# EAGLE design chainable_shift_register (EAGLE 9.5.0)
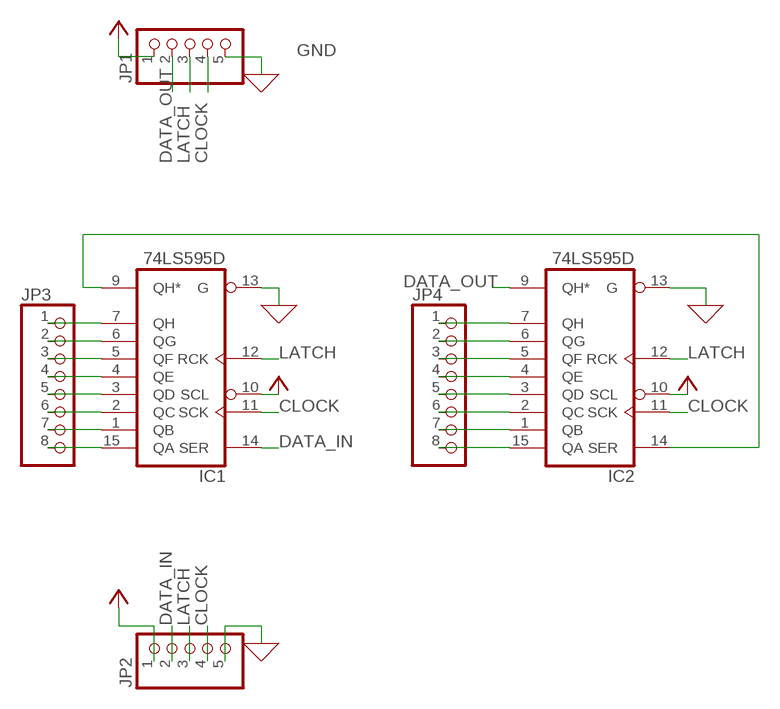
[diagram p0: schematic, sheet 1]

## Parts
IC1  74LS595D  [SO16]
IC2  74LS595D  [SO16]
JP1  PINHD-1X5  [1X05]
JP2  PINHD-1X5  [1X05]
JP3  PINHD-1X8  [1X08]
JP4  PINHD-1X8  [1X08]

## Nets
CLOCK: IC1.11(SCK) IC2.11(SCK) JP1.4 JP2.4
DATA_IN: IC1.14(SER) JP2.2
DATA_OUT: IC2.9(QH*) JP1.2
GND: IC1.13(G) IC2.13(G) JP1.5 JP2.5
LATCH: IC1.12(RCK) IC2.12(RCK) JP1.3 JP2.3
N$1: IC2.15(QA) JP4.8
N$2: IC2.1(QB) JP4.7
N$3: IC2.2(QC) JP4.6
N$4: IC2.3(QD) JP4.5
N$5: IC2.4(QE) JP4.4
N$6: IC2.5(QF) JP4.3
N$7: IC2.6(QG) JP4.2
N$8: IC2.7(QH) JP4.1
N$9: IC1.7(QH) JP3.1
N$10: IC1.6(QG) JP3.2
N$11: IC1.5(QF) JP3.3
N$12: IC1.4(QE) JP3.4
N$13: IC1.3(QD) JP3.5
N$14: IC1.2(QC) JP3.6
N$15: IC1.1(QB) JP3.7
N$16: IC1.15(QA) JP3.8
N$17: IC1.9(QH*) IC2.14(SER)
VCC: IC1.10(SCL) IC2.10(SCL) JP1.1 JP2.1

## Power pins joined to a net without a drawn wire
GND: IC1.8(GND) IC2.8(GND)
VCC: IC1.16(VCC) IC2.16(VCC)

## Library data of the parts
IC1 IC2 = 74xx-us:74*595: 8-bit SHIFT REGISTER, output latch
JP1 JP2 = pinhead:PINHD-1X5: PIN HEADER
JP3 JP4 = pinhead:PINHD-1X8: PIN HEADER

## Board
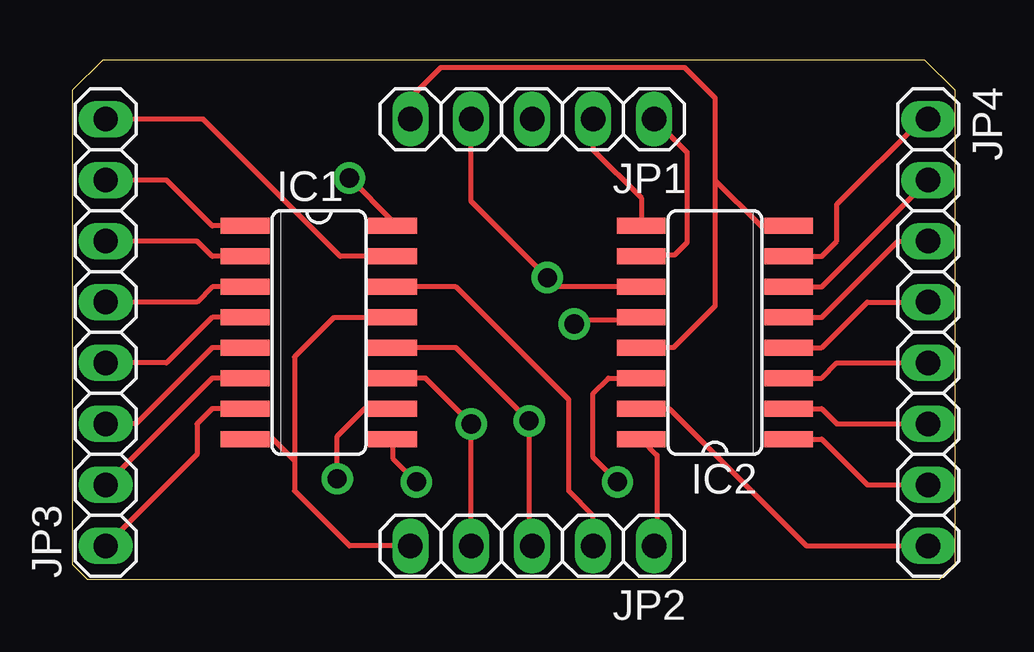
[diagram p1: board, top side]
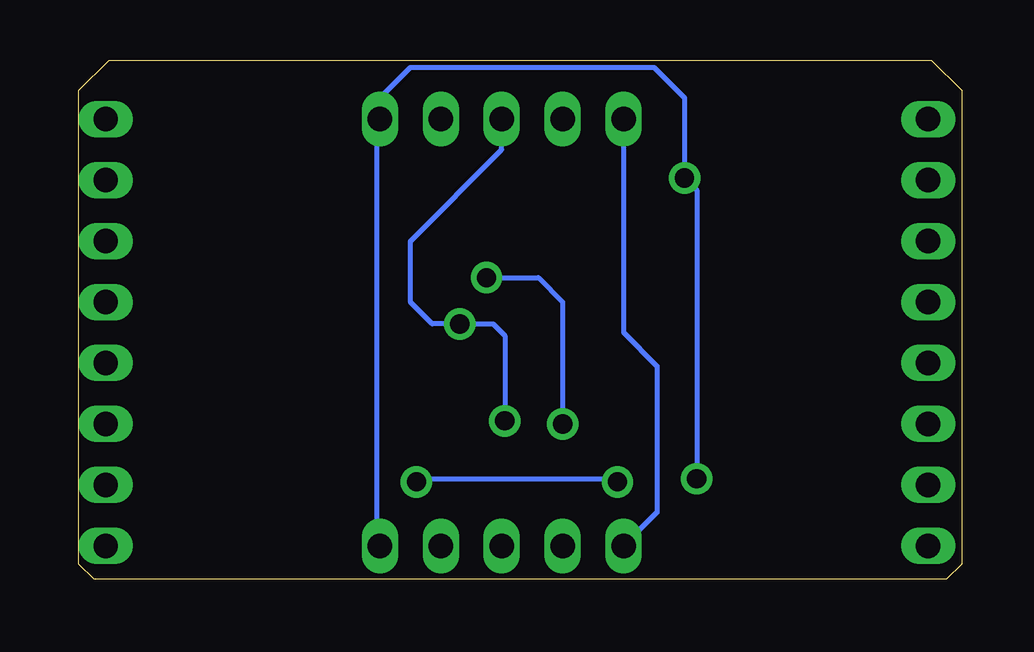
[diagram p2: board, bottom side, seen from below]

Size 36.81 x 21.64 mm. Coordinates in mm from the lower left corner, seen from the top.
Outline: 0,20.37 0,0.64 0.64,0 36.17,0 36.81,0.64 36.81,20.37 35.54,21.64 1.27,21.64 0,20.37
Copper layers (1*16): Top 0.035mm / dielectric 1.5mm / Bottom 0.035mm
Design rules "OthermillDRC_1_32_v2": minimum track width 8mil, minimum drill 0.8mm, track to track 0.794003125mm, track to pad 0.794003125mm, pad to pad 0.794003125mm, via to via 0.794003125mm, smd to smd 0mil, copper to edge 0mil, drill to drill 1mil, minimum pad ring 10mil, minimum via ring 10mil, stop-mask expansion 1mil, vias tented up to drill 30mil, thermal gap 10mil

### Footprints (pad centres in the part's own frame; a part is rotated, then mirrored left to right if it is on the bottom)
SO16 = smd 0.66 x 2.032: 1 -4.445,-3.073; 2 -3.175,-3.073; 3 -1.905,-3.073; 4 -0.635,-3.073; 5 0.635,-3.073; 6 1.905,-3.073; 7 3.175,-3.073; 8 4.445,-3.073; 9 4.445,3.073; 10 3.175,3.073; 11 1.905,3.073; 12 0.635,3.073; 13 -0.635,3.073; 14 -1.905,3.073; 15 -3.175,3.073; 16 -4.445,3.073
1X05 = drill 1.016 long: 1 -5.08,0; 2 -2.54,0; 3 0,0; 4 2.54,0; 5 5.08,0
1X08 = drill 1.016 long: 1 -8.89,0; 2 -6.35,0; 3 -3.81,0; 4 -1.27,0; 5 1.27,0; 6 3.81,0; 7 6.35,0; 8 8.89,0

### Placement (x,y rotation side)
IC1  10.29,10.29 270 top
IC2  26.8,10.29 90 top
JP1  19.18,19.18 180 top
JP2  19.18,1.4 180 top
JP3  1.4,10.29 90 top
JP4  35.69,10.29 270 top

### Tracks (layer width: path | path; a pad name or v marks a point on that pad's centre or on a via)
CLOCK  (via drill 0.8)
  Top 0.203: JP2.4 v16.64,6.48 14.73,8.38 IC1.11 | IC2.11 20.19,12.19 v19.81,12.57 16.64,15.75 JP1.4
  Bottom 0.203: v19.81,12.57 17.65,12.57 16.64,11.56 v16.64,6.48
DATA_IN
  Top 0.203: JP2.2 21.72,2.67 20.7,3.68 20.7,7.49 16,12.19 IC1.14
DATA_OUT
  Top 0.203: JP1.2 21.72,17.91 23.72,15.9 IC2.9
GND
  Top 0.203: IC1.13 10.92,10.92 9.27,9.27 9.27,4.95 | 9.27,4.95 9.27,3.68 11.56,1.4 JP2.5 | 9.27,4.95 8.38,5.84 IC1.8 | IC2.13 25.07,9.65 26.8,11.38 26.8,16.64 | IC2.8 28.7,14.73 26.8,16.64 | JP1.5 14.1,20.07 15.37,21.34 25.53,21.34 26.8,20.07 26.8,16.64
  Bottom 0.203: JP1.5 14.1,10.29 12.7,8.89 12.7,2.79 JP2.5
LATCH  (via drill 0.8)
  Top 0.203: JP2.3 19.05,1.52 v19.05,6.6 16,9.65 IC1.12 | IC2.12 23.6,10.79 21.08,10.79 v20.93,10.64
  Bottom 0.203: v19.05,6.6 19.05,10.16 19.53,10.64 v20.93,10.64 22.07,10.64 22.99,11.56 22.99,14.1 19.18,17.91 JP1.3
N$1
  Top 0.203: IC2.15 24.89,7.11 30.61,1.4 JP4.8
N$2
  Top 0.203: IC2.1 31.24,5.84 33.15,3.94 JP4.7
N$3
  Top 0.203: IC2.2 31.24,7.11 31.88,6.48 JP4.6
N$4
  Top 0.203: IC2.3 31.24,8.38 31.88,9.02 JP4.5
N$5
  Top 0.203: IC2.4 31.24,9.65 33.15,11.56 JP4.4
N$6
  Top 0.203: IC2.5 31.24,10.92 34.42,14.1 JP4.3
N$7
  Top 0.203: IC2.6 31.24,12.19 JP4.2
N$8
  Top 0.203: IC2.7 31.24,13.46 31.88,14.1 31.88,15.62 35.43,19.18 JP4.1
N$9
  Top 0.203: IC1.7 5.84,7.11 5.21,6.48 5.21,5.21 JP3.1
N$10
  Top 0.203: IC1.6 5.84,8.38 JP3.2
N$11
  Top 0.203: IC1.5 5.84,9.65 2.67,6.48 JP3.3
N$12
  Top 0.203: IC1.4 5.84,10.92 3.94,9.02 JP3.4
N$13
  Top 0.203: IC1.3 5.84,12.19 5.21,11.56 JP3.5
N$14
  Top 0.203: IC1.2 5.84,13.46 5.21,14.1 JP3.6
N$15
  Top 0.203: IC1.1 5.84,14.73 3.94,16.64 JP3.7
N$16
  Top 0.203: IC1.15 11.18,13.46 5.46,19.18 JP3.8
N$17  (via drill 0.8)
  Top 0.203: IC1.9 13.36,5.05 v14.35,4.06 | v22.73,4.06 21.72,5.08 21.72,7.75 22.35,8.38 IC2.14
  Bottom 0.203: v22.73,4.06 22.61,4.19 14.48,4.19 v14.35,4.06
VCC  (via drill 0.8)
  Top 0.203: IC2.16 24.38,5.18 24.38,1.52 JP2.1 | JP1.1 25.64,17.8 25.64,14.03 25.11,13.51 23.77,13.51 IC2.10 | IC1.10 12.19,7.11 11.05,5.97 v11.05,4.19 | v11.56,16.73 13.36,14.92 IC1.16
  Bottom 0.203: v11.56,16.73 11.56,20.07 12.83,21.34 22.99,21.34 24.26,20.07 JP1.1 24.38,19.05 24.38,1.52 JP2.1 | 11.56,16.64 v11.56,16.73 | v11.56,16.73 11.05,16.22 v11.05,4.19